# Altium schematic sheet [02]-ESP32.SchDoc
size A4; SheetNumber: 2; SheetTotal: 4
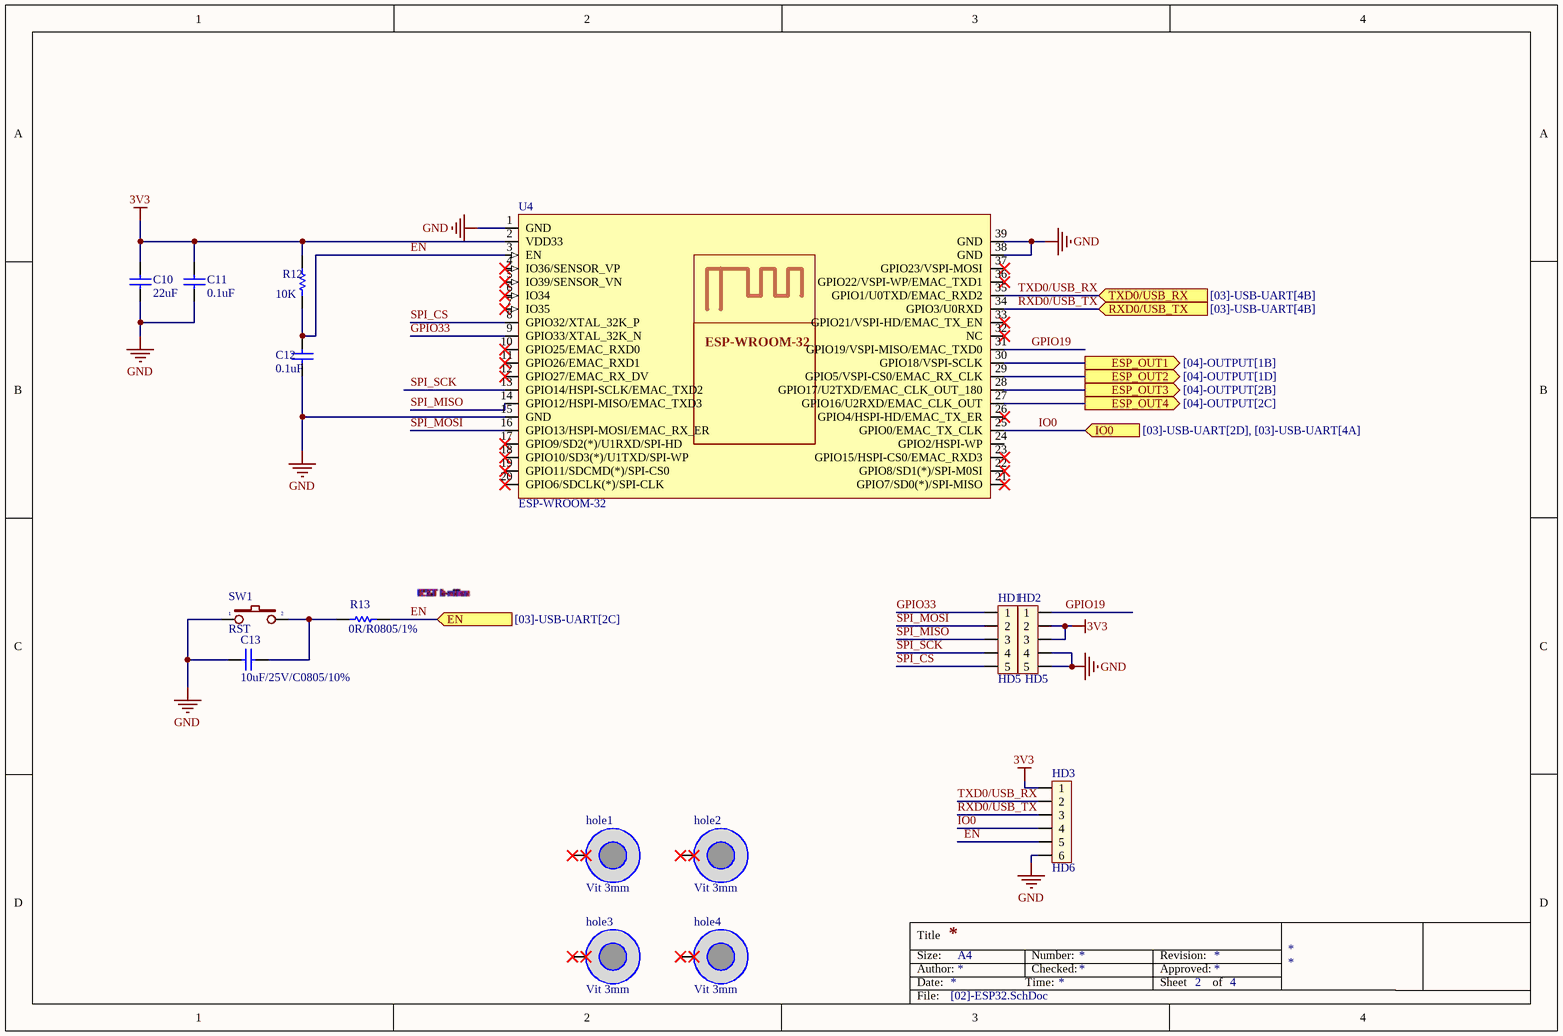
[diagram p0: [02]-ESP32.SchDoc]

## Parts
C10  22uF  [CAP_CERA_C2012(CC0805INCH)]
C11  0.1uF  [CAP_CERA_C2012(CC0805INCH)]
C12  0.1uF  [CAP_CERA_C2012(CC0805INCH)]
C13  10uF/25V/C0805/10%  [CAP_CERA_C2012(CC0805INCH)]
HD1  HD5  [Header_5]
HD2  HD5  [Header_5]
HD3  HD6  [Header_6]
hole1  Vit 3mm  [Screw 3.0]
hole2  Vit 3mm  [Screw 3.0]
hole3  Vit 3mm  [Screw 3.0]
hole4  Vit 3mm  [Screw 3.0]
R12  10K  [Res 0805 SMD]
R13  0R/R0805/1%  [Res 0805 SMD]
SW1  RST  [Button 3x4mm]
U4  ESP-WROOM-32  [ESP32 WROOM]

## Ports
EN (in, see [03]-USB-UART[2C]), ESP_OUT1 (out, see [04]-OUTPUT[1B]), ESP_OUT2 (out, see [04]-OUTPUT[1D]), ESP_OUT3 (out, see [04]-OUTPUT[2B]), ESP_OUT4 (out, see [04]-OUTPUT[2C]), IO0 (in, see [03]-USB-UART[2D], [03]-USB-UART[4A]), RXD0/USB_TX (in, see [03]-USB-UART[4B]), TXD0/USB_RX (in, see [03]-USB-UART[4B])

## Nets
3V3: C10.2 C11.2 HD2.2 HD2.3 HD3.1 R12.2 U4.2(VDD33)
GND: C10.1 C11.1 C12.1 C13.1 HD2.4 HD2.5 HD3.6 SW1.1 U4.1(GND) U4.15(GND) U4.38(GND) U4.39(GND)
EN: C12.2 HD3.5 R12.1 R13.2 U4.3(EN) ; port EN
ESP_OUT1: U4.30(GPIO18/VSPI-SCLK) ; port ESP_OUT1
ESP_OUT2: U4.29(GPIO5/VSPI-CS0/EMAC_RX_CLK) ; port ESP_OUT2
ESP_OUT3: U4.28(GPIO17/U2TXD/EMAC_CLK_OUT_180) ; port ESP_OUT3
ESP_OUT4: U4.27(GPIO16/U2RXD/EMAC_CLK_OUT) ; port ESP_OUT4
GPIO19: HD2.1 U4.31(GPIO19/VSPI-MISO/EMAC_TXD0)
GPIO33: HD1.1 U4.9(GPIO33/XTAL_32K_N)
IO0: HD3.4 U4.25(GPIO0/EMAC_TX_CLK) ; port IO0
RXD0/USB_TX: HD3.3 U4.34(GPIO3/U0RXD) ; port RXD0/USB_TX
SPI_CS: HD1.5 U4.8(GPIO32/XTAL_32K_P)
SPI_MISO: HD1.3 U4.14(GPIO12/HSPI-MISO/EMAC_TXD3)
SPI_MOSI: HD1.2 U4.16(GPIO13/HSPI-MOSI/EMAC_RX_ER)
SPI_SCK: HD1.4 U4.13(GPIO14/HSPI-SCLK/EMAC_TXD2)
TXD0/USB_RX: HD3.2 U4.35(GPIO1/U0TXD/EMAC_RXD2) ; port TXD0/USB_RX
NetC13_2: C13.2 R13.1 SW1.2

Not connected (* = marked no-connect by the designer): hole1 1(hole)*; hole2 1(hole)*; hole3 1(hole)*; hole4 1(hole)*; U4 4(IO36/SENSOR_VP)* 5(IO39/SENSOR_VN)* 6(IO34)* 7(IO35)* 10(GPIO25/EMAC_RXD0)* 11(GPIO26/EMAC_RXD1)* 12(GPIO27/EMAC_RX_DV)* 17(GPIO9/SD2(*)/U1RXD/SPI-HD)* 18(GPIO10/SD3(*)/U1TXD/SPI-WP)* 19(GPIO11/SDCMD(*)/SPI-CS0)* 20(GPIO6/SDCLK(*)/SPI-CLK)* 21(GPIO7/SD0(*)/SPI-MISO)* 22(GPIO8/SD1(*)/SPI-M0SI)* 23(GPIO15/HSPI-CS0/EMAC_RXD3)* 24(GPIO2/HSPI-WP) 26(GPIO4/HSPI-HD/EMAC_TX_ER)* 32(NC)* 33(GPIO21/VSPI-HD/EMAC_TX_EN)* 36(GPIO22/VSPI-WP/EMAC_TXD1)* 37(GPIO23/VSPI-MOSI)*

## Notes on the sheet
- Title
- Size:
- Date:
- Author:
- A4
- Time:
- Number:
- Checked:
- Revision:
- Sheet
- Approved:
- of
- File:

## Library data of the parts
C10 = 0.1uF/50V/C0603/10%_1: 22µF ±20% 25V Ceramic Capacitor X5R 0805 (2012 Metric); Manufacturer: Tariff Applied; ComponentLink1URL: http://www.murata.com/~/media/webrenewal/support/library/catalog/products/capacitor/mlcc/c02e.ashx; ComponentLink1Description: http://www.murata.com/~/media/webrenewal/support/library/catalog/products/capacitor/mlcc/c02e.ashx; Digikey: 1276-2908-1-ND
C11 C12 = 0.1uF/50V/C0603/10%_2: 0.1µF ±10% 25V Ceramic Capacitor X7R 0805 (2012 Metric); ComponentLink1URL: http://www.murata.com/~/media/webrenewal/support/library/catalog/products/capacitor/mlcc/c02e.ashx; ComponentLink1Description: http://www.murata.com/~/media/webrenewal/support/library/catalog/products/capacitor/mlcc/c02e.ashx; Digikey: 478-3755-1-ND
C13 = 0.1uF/50V/C0603/10%_6: 0.1µF ±10% 25V Ceramic Capacitor X7R 0805 (2012 Metric); ComponentLink1URL: http://www.murata.com/~/media/webrenewal/support/library/catalog/products/capacitor/mlcc/c02e.ashx; ComponentLink1Description: http://www.murata.com/~/media/webrenewal/support/library/catalog/products/capacitor/mlcc/c02e.ashx; Digikey: 478-3755-1-ND
HD1 HD2 = Header5: Header 5; Creat by: VanDungEvn@Gmail.com
HD3 = Header6: Header 6; Creat by: VanDungEvn@Gmail.com
R12 = 34.8K/R0805/1%_2: 10 kOhms ±1% 0.125W, 1/8W Chip Resistor 0805 (2012 Metric) Thick Film; Power Rating: 100mW; Resistance: 34.8kR; Voltage Rating: 50V; Case/Package: 0603; Case Code (Imperial): 0603; Case Code (Metric): 1608; Min Operating Temperature: -55°C; Max Operating Temperature: 155°C; Termination: SMD/SMT; Military Standard: Not; Voltage Rating (DC): 50V; Length: 1.6mm; Height: 0.45mm; Width: 0.8mm; Depth: 0.8mm; Lead Free: Lead Free; Digikey: A126332CT-ND
R13 = 200K/R0603/1%_1: 0 Ohms Jumper 0.125W, 1/8W Chip Resistor 0805 (2012 Metric) Automotive AEC-Q200 Thick Film; Part Status: Active; Height - Seated (Max): 0.022" (0.55mm); Failure Rate: -; ComponentLink1URL: http://www.yageo.com/documents/recent/PYu-RC_Group_51_RoHS_L_7.pdf; ComponentLink1Description: http://www.yageo.com/documents/recent/PYu-RC_Group_51_RoHS_L_7.pdf; Digikey: 541-0.0ACT-ND
SW1 = SW2: SWITCH TACTILE SPST-NO 0.05A 12V; Digikey: CKN10384CT-ND